# EAGLE design GB TSOP44 ROM ADAPTER.c (EAGLE 9.2.2)
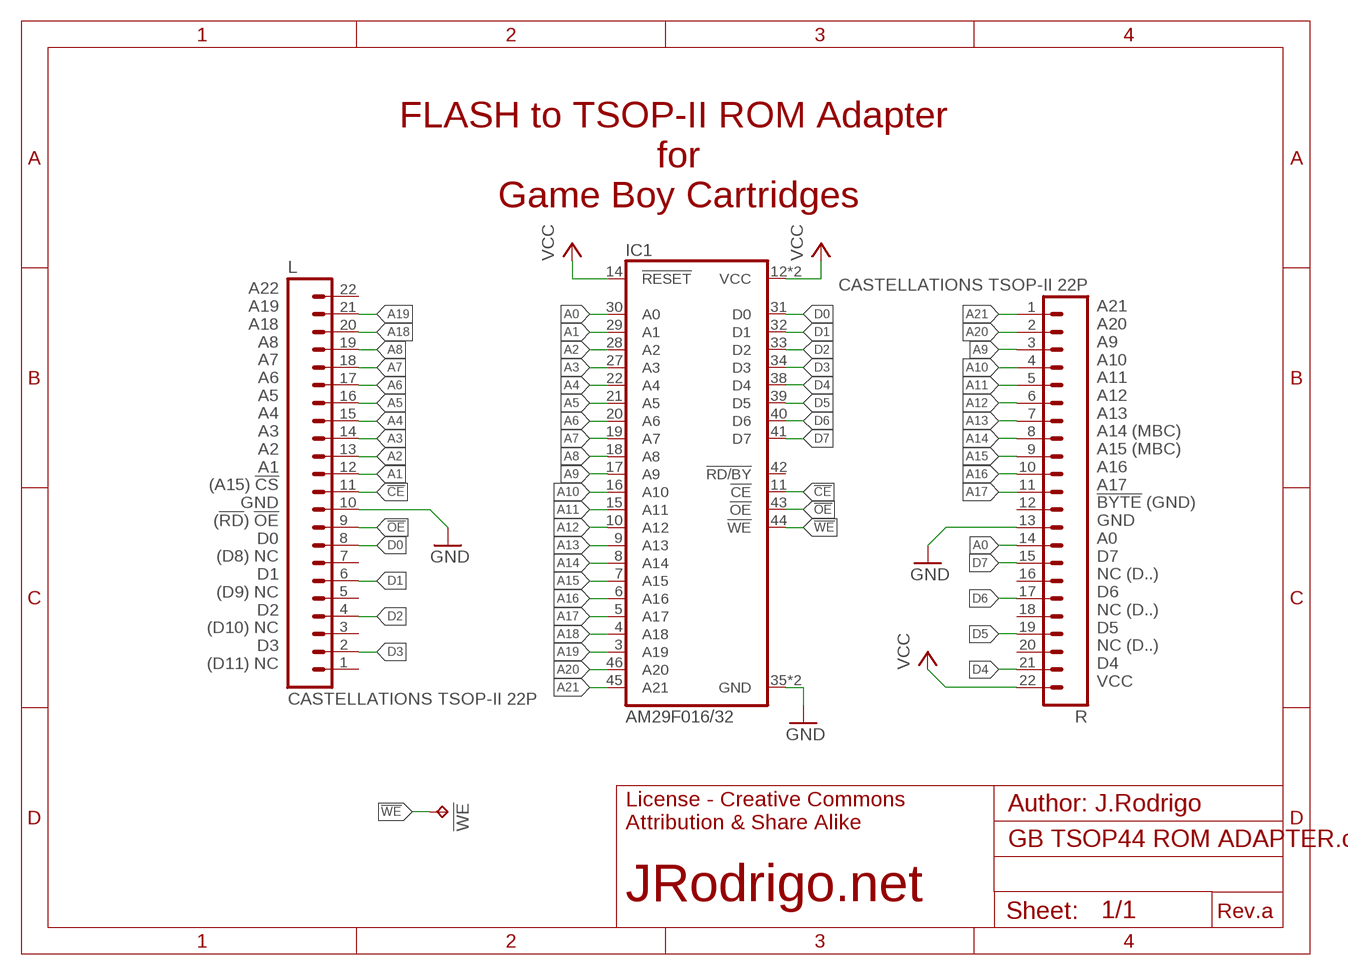
[diagram p0: schematic, sheet 1]

## Parts
!WE  TPTP06SQ  [TP06SQ]
IC1  AM29F016/32  AM29FXXXCUSTOM  [TSOP48-2]
L  CASTELLATIONS TSOP-II 22P  CASTELLATIONS_TSOP-II-22PHH  [CASTELLATIONS_TSOP_II_22PHH]
R  CASTELLATIONS TSOP-II 22P  CASTELLATIONS_TSOP-II-22PHH  [CASTELLATIONS_TSOP_II_22PHH]

## Nets
!CE: IC1.11(!CE) L.11
!OE: IC1.43(!OE) L.9
!WE: !WE.TP IC1.44(!WE)
A0: IC1.30(A0) R.14
A1: IC1.29(A1) L.12
A2: IC1.28(A2) L.13
A3: IC1.27(A3) L.14
A4: IC1.22(A4) L.15
A5: IC1.21(A5) L.16
A6: IC1.20(A6) L.17
A7: IC1.19(A7) L.18
A8: IC1.18(A8) L.19
A9: IC1.17(A9) R.3
A10: IC1.16(A10) R.4
A11: IC1.15(A11) R.5
A12: IC1.10(A12) R.6
A13: IC1.9(A13) R.7
A14: IC1.8(A14) R.8
A15: IC1.7(A15) R.9
A16: IC1.6(A16) R.10
A17: IC1.5(A17) R.11
A18: IC1.4(A18) L.20
A19: IC1.3(A19) L.21
A20: IC1.46(A20) R.2
A21: IC1.45(A21) R.1
D0: IC1.31(D0) L.8
D1: IC1.32(D1) L.6
D2: IC1.33(D2) L.4
D3: IC1.34(D3) L.2
D4: IC1.38(D4) R.21
D5: IC1.39(D5) R.19
D6: IC1.40(D6) R.17
D7: IC1.41(D7) R.15
GND: IC1.35(GND) IC1.36(GND) L.10 R.13
VCC: IC1.12(VCC) IC1.14(!RESET) IC1.37(VCC) R.22
Unconnected: IC1.42(!RD/BY) L.1 L.3 L.5 L.7 L.22 R.12 R.16 R.18 R.20

## Notes on the sheet
- FLASH to TSOP-II ROM Adapter 
  for
  Game Boy Cartridges
- A22
  A19
  A18
  A8
  A7
  A6
  A5
  A4
  A3
  A2
  A1
  (A15) !CS!
  GND
  (!RD!) !OE!
  D0
  (D8) NC
  D1
  (D9) NC
  D2
  (D10) NC
  D3
  (D11) NC
- A21
  A20
  A9
  A10
  A11
  A12
  A13
  A14 (MBC)
  A15 (MBC)
  A16
  A17
  !BYTE! (GND)
  GND
  A0
  D7
  NC (D..)
  D6
  NC (D..)
  D5
  NC (D..)
  D4
  VCC
- Author: J.Rodrigo
- License - Creative Commons
  Attribution & Share Alike
- JRodrigo.net
- Rev.a

## Library data of the parts
!WE = testpad:TP: Test pad
IC1 = jrodrigo-gameboy:AM29FXXX: FLASH MEMORY
L R = jrodrigo-gameboy:CASTELLATIONS_TSOP-II-22P

## Board
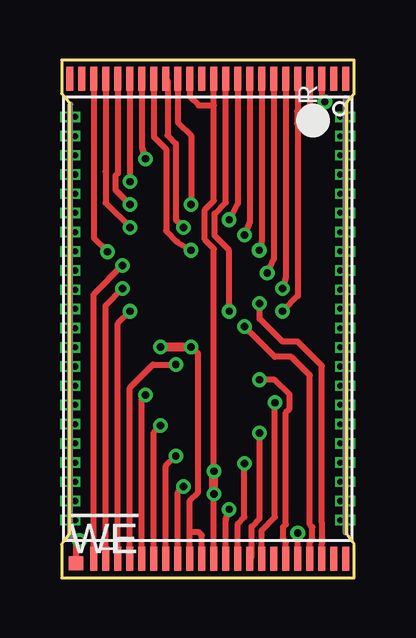
[diagram p1: board, top side]
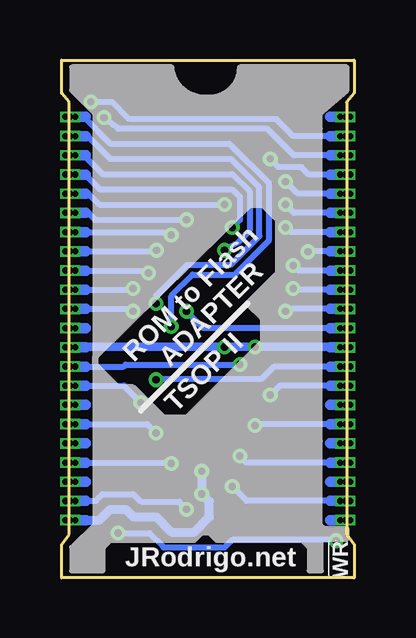
[diagram p2: board, bottom side, seen from below]

Size 12.19 x 21.58 mm. Coordinates in mm from the lower left corner, seen from the top.
Outline: 0,0 12.19,0 12.19,1.4 11.87,1.83 11.87,19.81 12.19,20.19 12.19,21.58 0,21.58 0,20.19 0.32,19.81 0.32,1.83 0,1.4 0,0
Copper layers (1*16): Top 0.0356mm / dielectric 1.5011mm / Bottom 0.0356mm
Design rules "oshpark-2layer *": minimum track width 6mil, minimum drill 13mil, track to track 6mil, track to pad 6mil, pad to pad 6mil, via to via 6mil, smd to smd 6mil, copper to edge 15mil, drill to drill 6mil, minimum pad ring 2.5mil, minimum via ring 6mil, stop-mask expansion 2.5mil, vias tented up to drill 20mil, thermal gap 10mil

### Footprints (pad centres in the part's own frame; a part is rotated, then mirrored left to right if it is on the bottom)
TP06SQ = smd 0.6 x 0.6: TP 0,0
TSOP48-2 = smd 1 x 0.3: 1 -10,5.75; 2 -10,5.25; 3 -10,4.75; 4 -10,4.25; 5 -10,3.75; 6 -10,3.25; 7 -10,2.75; 8 -10,2.25; 9 -10,1.75; 10 -10,1.25; 11 -10,0.75; 12 -10,0.25; 13 -10,-0.25; 14 -10,-0.75; 15 -10,-1.25; 16 -10,-1.75; 17 -10,-2.25; 18 -10,-2.75; 19 -10,-3.25; 20 -10,-3.75; 21 -10,-4.25; 22 -10,-4.75; 23 -10,-5.25; 24 -10,-5.75; 27 10,-4.75; 28 10,-4.25; 29 10,-3.75; 30 10,-3.25; 31 10,-2.75; 32 10,-2.25; 33 10,-1.75; 34 10,-1.25; 35 10,-0.75; 36 10,-0.25; 37 10,0.25; 38 10,0.75; 39 10,1.25; 40 10,1.75; 41 10,2.25; 42 10,2.75; 43 10,3.25; 44 10,3.75; 45 10,4.25; 46 10,4.75; 47 10,5.25; 48 10,5.75
CASTELLATIONS_TSOP_II_22PHH = drill 0.254 pad 0.432 square: 1 0,0; 2 0.8,0; 3 1.6,0; 4 2.4,0; 5 3.2,0; 6 4,0; 7 4.801,0; 8 5.601,0; 9 6.401,0; 10 7.201,0; 11 8.001,0; 12 8.801,0; 13 9.601,0; 14 10.401,0; 15 11.201,0; 16 12.002,0; 17 12.802,0; 18 13.602,0; 19 14.402,0; 20 15.202,0; 21 16.002,0; 22 16.802,0; 23 0,0.203; 24 0.8,0.203; 25 1.6,0.203; 26 2.4,0.203; 27 3.2,0.203; 28 4,0.203; 29 4.801,0.203; 30 5.601,0.203; 31 6.401,0.203; 32 7.201,0.203; 33 8.001,0.203; 34 8.801,0.203; 35 9.601,0.203; 36 10.401,0.203; 37 11.201,0.203; 38 12.002,0.203; 39 12.802,0.203; 40 13.602,0.203; 41 14.402,0.203; 42 15.202,0.203; 43 16.002,0.203; 44 16.802,0.203; 45 0,-0.203; 46 0.8,-0.203; 47 1.6,-0.203; 48 2.4,-0.203; 49 3.2,-0.203; 50 4,-0.203; 51 4.801,-0.203; 52 5.601,-0.203; 53 6.401,-0.203; 54 7.201,-0.203; 55 8.001,-0.203; 56 8.801,-0.203; 57 9.601,-0.203; 58 10.401,-0.203; 59 11.201,-0.203; 60 12.002,-0.203; 61 12.802,-0.203; 62 13.602,-0.203; 63 14.402,-0.203; 64 15.202,-0.203; 65 16.002,-0.203; 66 16.802,-0.203

### Placement (x,y rotation side)
!WE  0.61,0.61 0 top
IC1  6.1,10.79 270 top
L  0.37,2.41 90 top
R  11.82,19.21 270 top

### Tracks (layer width: path | path; a pad name or v marks a point on that pad's centre or on a via)
!CE  (via drill 0.3)
  Top 0.254: v6.99,11.11 6.99,13.65 6.38,14.26 6.38,15.18 6.85,15.65 IC1.11
  Bottom 0.254: L.11 6.28,10.41 v6.99,11.11
!OE  (via drill 0.3)
  Top 0.254: v8.26,8.26 8.89,8.26 9.5,7.64 9.5,7.05 9.35,6.9 9.35,2.23 9.23,2.12 9.23,1.61 9.35,1.5 IC1.43
  Bottom 0.254: v8.26,8.26 8.23,8.28 3.87,8.28 3.35,8.81 L.9
!WE  (via drill 0.3)  (1 unrouted)
  Top 0.254: IC1.44 v9.84,1.87 9.84,1.91 | 0.64,0.65 !WE.TP 0.61,1.33 0.76,1.54
  Bottom 0.254: v9.84,1.87 8.53,1.87 7.94,1.27 5.4,1.27 5.08,1.59 0.67,1.59 v0.75,1.55
A0  (via drill 0.3)
  Top 0.254: IC1.30 2.85,7.93 3.81,8.89 v4.76,8.89
  Bottom 0.254: 11.77,8.89 R.14 9.61,8.81 9.52,8.89 v4.76,8.89
A1  (via drill 0.3)
  Top 0.254: IC1.29 2.35,10.6 v2.86,11.11
  Bottom 0.254: L.12 2.76,11.21 v2.86,11.11
A2  (via drill 0.3)
  Top 0.254: IC1.28 1.85,11.37 v2.54,12.06
  Bottom 0.254: L.13 2.48,12.01 v2.54,12.06
A3  (via drill 0.3)
  Top 0.254: IC1.27 1.35,11.82 v2.54,13.02
  Bottom 0.254: L.14 2.33,12.81 v2.54,13.02
A4  (via drill 0.3)
  Top 0.254: v1.92,13.59 1.35,14.16 IC1.22
  Bottom 0.254: L.15 1.9,13.61 v1.92,13.59
A5  (via drill 0.3)
  Top 0.254: IC1.21 1.85,16.93 1.84,16.93 1.84,15.62 v2.86,14.61
  Bottom 0.254: L.16 2.66,14.41 v2.86,14.61
A6  (via drill 0.3)
  Top 0.254: IC1.20 2.35,16.86 2.25,16.76 2.25,16.17 v2.86,15.56
  Bottom 0.254: L.17 2.51,15.21 v2.86,15.56
A7  (via drill 0.3)
  Top 0.254: IC1.19 2.85,16.52 v2.86,16.51
  Bottom 0.254: L.18 2.36,16.01 v2.86,16.51
A8  (via drill 0.3)
  Top 0.254: IC1.18 3.35,17.93 v3.49,17.46
  Bottom 0.254: v3.49,17.46 3.15,17.12 2.2,17.12 1.89,16.81 L.19
A9  (via drill 0.3)
  Top 0.254: v5.4,13.65 5.37,13.68 4.83,13.99 4.36,14.47 4.36,17.87 3.85,18.38 IC1.17
  Bottom 0.254: v5.4,13.65 5.37,13.68 4.83,13.99 4.36,14.47 4.36,16.1 5.08,16.83 10.48,16.83 11.26,17.61 R.3
A10  (via drill 0.3)
  Top 0.254: IC1.16 4.42,20.72 4.42,18.44 4.76,18.1 4.76,14.92 v5.08,14.61
  Bottom 0.254: v5.08,14.61 4.76,14.92 4.76,15.88 5.08,16.19 10.59,16.19 11.21,16.81 R.4
A11  (via drill 0.3)
  Top 0.254: IC1.15 4.85,18.97 5.4,18.41 v5.4,15.56
  Bottom 0.254: v5.4,15.56 10.62,15.56 11.07,16.01 11.13,16.01 R.5
A12  (via drill 0.3)
  Top 0.254: IC1.10 7.35,15.6 v6.99,14.92
  Bottom 0.254: R.6 11.08,15.21 10.79,14.92 v6.99,14.92
A13  (via drill 0.3)
  Top 0.254: IC1.9 7.85,14.83 v7.62,14.29
  Bottom 0.254: R.7 7.74,14.41 v7.62,14.29
A14  (via drill 0.3)
  Top 0.254: IC1.8 8.35,14.06 8.26,13.65 v8.24,13.65
  Bottom 0.254: R.8 8.28,13.61 v8.24,13.65
A15  (via drill 0.3)
  Top 0.254: IC1.7 8.85,13.29 v8.57,12.7
  Bottom 0.254: R.9 8.68,12.81 v8.57,12.7
A16  (via drill 0.3)
  Top 0.254: IC1.6 9.35,12.52 v9.21,12.06
  Bottom 0.254: R.10 9.26,12.01 v9.21,12.06
A17  (via drill 0.3)
  Top 0.254: v9.21,11.11 9.85,11.75 9.85,18.9 9.82,18.92 9.82,19.43 9.85,19.46 IC1.5
  Bottom 0.254: R.11 9.3,11.21 v9.21,11.11
A18  (via drill 0.3)
  Top 0.254: IC1.4 10.35,19.18 v10.43,19.18
  Bottom 0.254: v10.43,19.18 9.82,18.71 3.62,18.71 2.52,17.61 L.20
A19  (via drill 0.3)
  Top 0.254: IC1.3 10.85,19.96 v10.97,19.84
  Bottom 0.254: v10.97,19.84 10.09,19.84 9.36,19.11 3.24,19.11 2.53,18.41 L.21
A20  (via drill 0.3)
  Top 0.254: IC1.46 10.85,1.43 10.86,1.45 10.86,2.29 10.85,2.3 10.85,8.84 9.84,9.84 9.21,9.84 8.26,10.79 v8.26,11.43
  Bottom 0.254: v8.26,11.43 8.26,11.75 6.96,13.04 5.14,13.04 3.95,14.24 3.95,16.27 5.14,17.46 10.16,17.46 11.11,18.41 R.2
A21  (via drill 0.3)
  Top 0.254: IC1.45 10.35,1.51 10.45,1.61 10.45,2.12 10.35,2.23 10.35,8.44 9.58,9.21 8.89,9.21 v7.62,10.48
  Bottom 0.254: v7.62,10.48 7.62,11.75 6.73,12.64 4.98,12.64 3.54,14.07 3.54,16.44 5.2,18.1 10.16,18.1 11.27,19.21 R.1
D0  (via drill 0.3)
  Top 0.254: IC1.31 3.35,7.47 v3.49,7.62
  Bottom 0.254: L.8 3.11,8.01 v3.49,7.62
D1  (via drill 0.3)
  Top 0.254: IC1.32 3.85,6.07 v4.13,6.35
  Bottom 0.254: L.6 4.07,6.41 v4.13,6.35
D2  (via drill 0.3)
  Top 0.254: IC1.33 4.35,4.66 v4.76,5.08
  Bottom 0.254: L.4 4.49,4.81 v4.76,5.08
D3  (via drill 0.3)
  Top 0.254: IC1.34 4.85,3.58 v5.08,3.81
  Bottom 0.254: L.2 4.48,3.21 v5.08,3.81
D4  (via drill 0.3)
  Top 0.254: IC1.38 6.85,2.4 v6.99,2.86
  Bottom 0.254: R.21 10.76,3.21 10.48,3.49 9.21,3.49 8.89,3.17 7.3,3.17 v6.99,2.86
D5  (via drill 0.3)
  Top 0.254: IC1.39 7.35,2.27 7.62,2.54 v7.62,4.76
  Bottom 0.254: R.19 7.66,4.81 v7.62,4.76
D6  (via drill 0.3)
  Top 0.254: IC1.40 7.92,0.87 7.92,2.14 8.26,2.48 v8.26,6.03
  Bottom 0.254: R.17 8.63,6.41 v8.26,6.03
D7  (via drill 0.3)
  Top 0.254: IC1.41 8.35,2 8.89,2.54 v8.89,7.3
  Bottom 0.254: R.15 9.59,8.01 v8.89,7.3
GND  (via drill 0.3)
  Top 0.254: IC1.36 5.85,1.77 5.71,1.91 5.35,1.91 | IC1.35 5.35,1.91 | 5.35,1.91 5.35,3.21 5.69,3.56 5.69,9.34 v5.4,9.63
  Top 0.381: v4.13,9.63 v5.4,9.63
  Bottom 0.381: L.10 v5.4,9.63 R.13
VCC  (via drill 0.3)
  Top 0.254: IC1.14 5.35,20.05 5.71,19.68 6.35,19.68 | 6.35,19.68 IC1.12 | IC1.37 v6.35,3.49 | v6.35,4.45 6.35,13.71 5.97,14.09 5.97,15.34 6.35,15.72 6.35,19.68
  Top 0.381: v6.35,3.49 v6.35,4.45
  Bottom 0.381: v6.35,4.45 v6.35,3.49 6.03,3.17 6.03,2.54 6.67,1.91 7.62,1.91 8.26,2.54 9.21,2.54 9.52,2.86 10.16,2.86 10.61,2.41 R.22

### Text on the board
b_Silk_Screen_Text: ROM to Flash / ADAPTER | TSOP II | !WR | JRodrigo.net